# Altium schematic sheet USB.SchDoc: USB interfaces
size A3; Organization: Use Organization_Name in ProjParam; Address1: Eliot Ferragni; Address2: STI-MOBOTS; Address3: EPFL; Address4: CH-1015 LAUSANNE; DocumentNumber: 7; Revision: A; SheetNumber: 7; SheetTotal: 11; ApprovedBy: Init ApprovedBy in DocParam; CheckedBy: Init CheckedBy in DocParam; Author: Init Author in DocParam; CompanyName: Init CompanyName in DocParam; DrawnBy: Init DrawBy in DocParam; Engineer: Init Engineer in DocParam; Title2: USB-C connector, USB-PD, Hub, protection, HS Phy; DocumentName: Init DocumentName in DocParam; ProjectName: Init ProjectName in DocParam
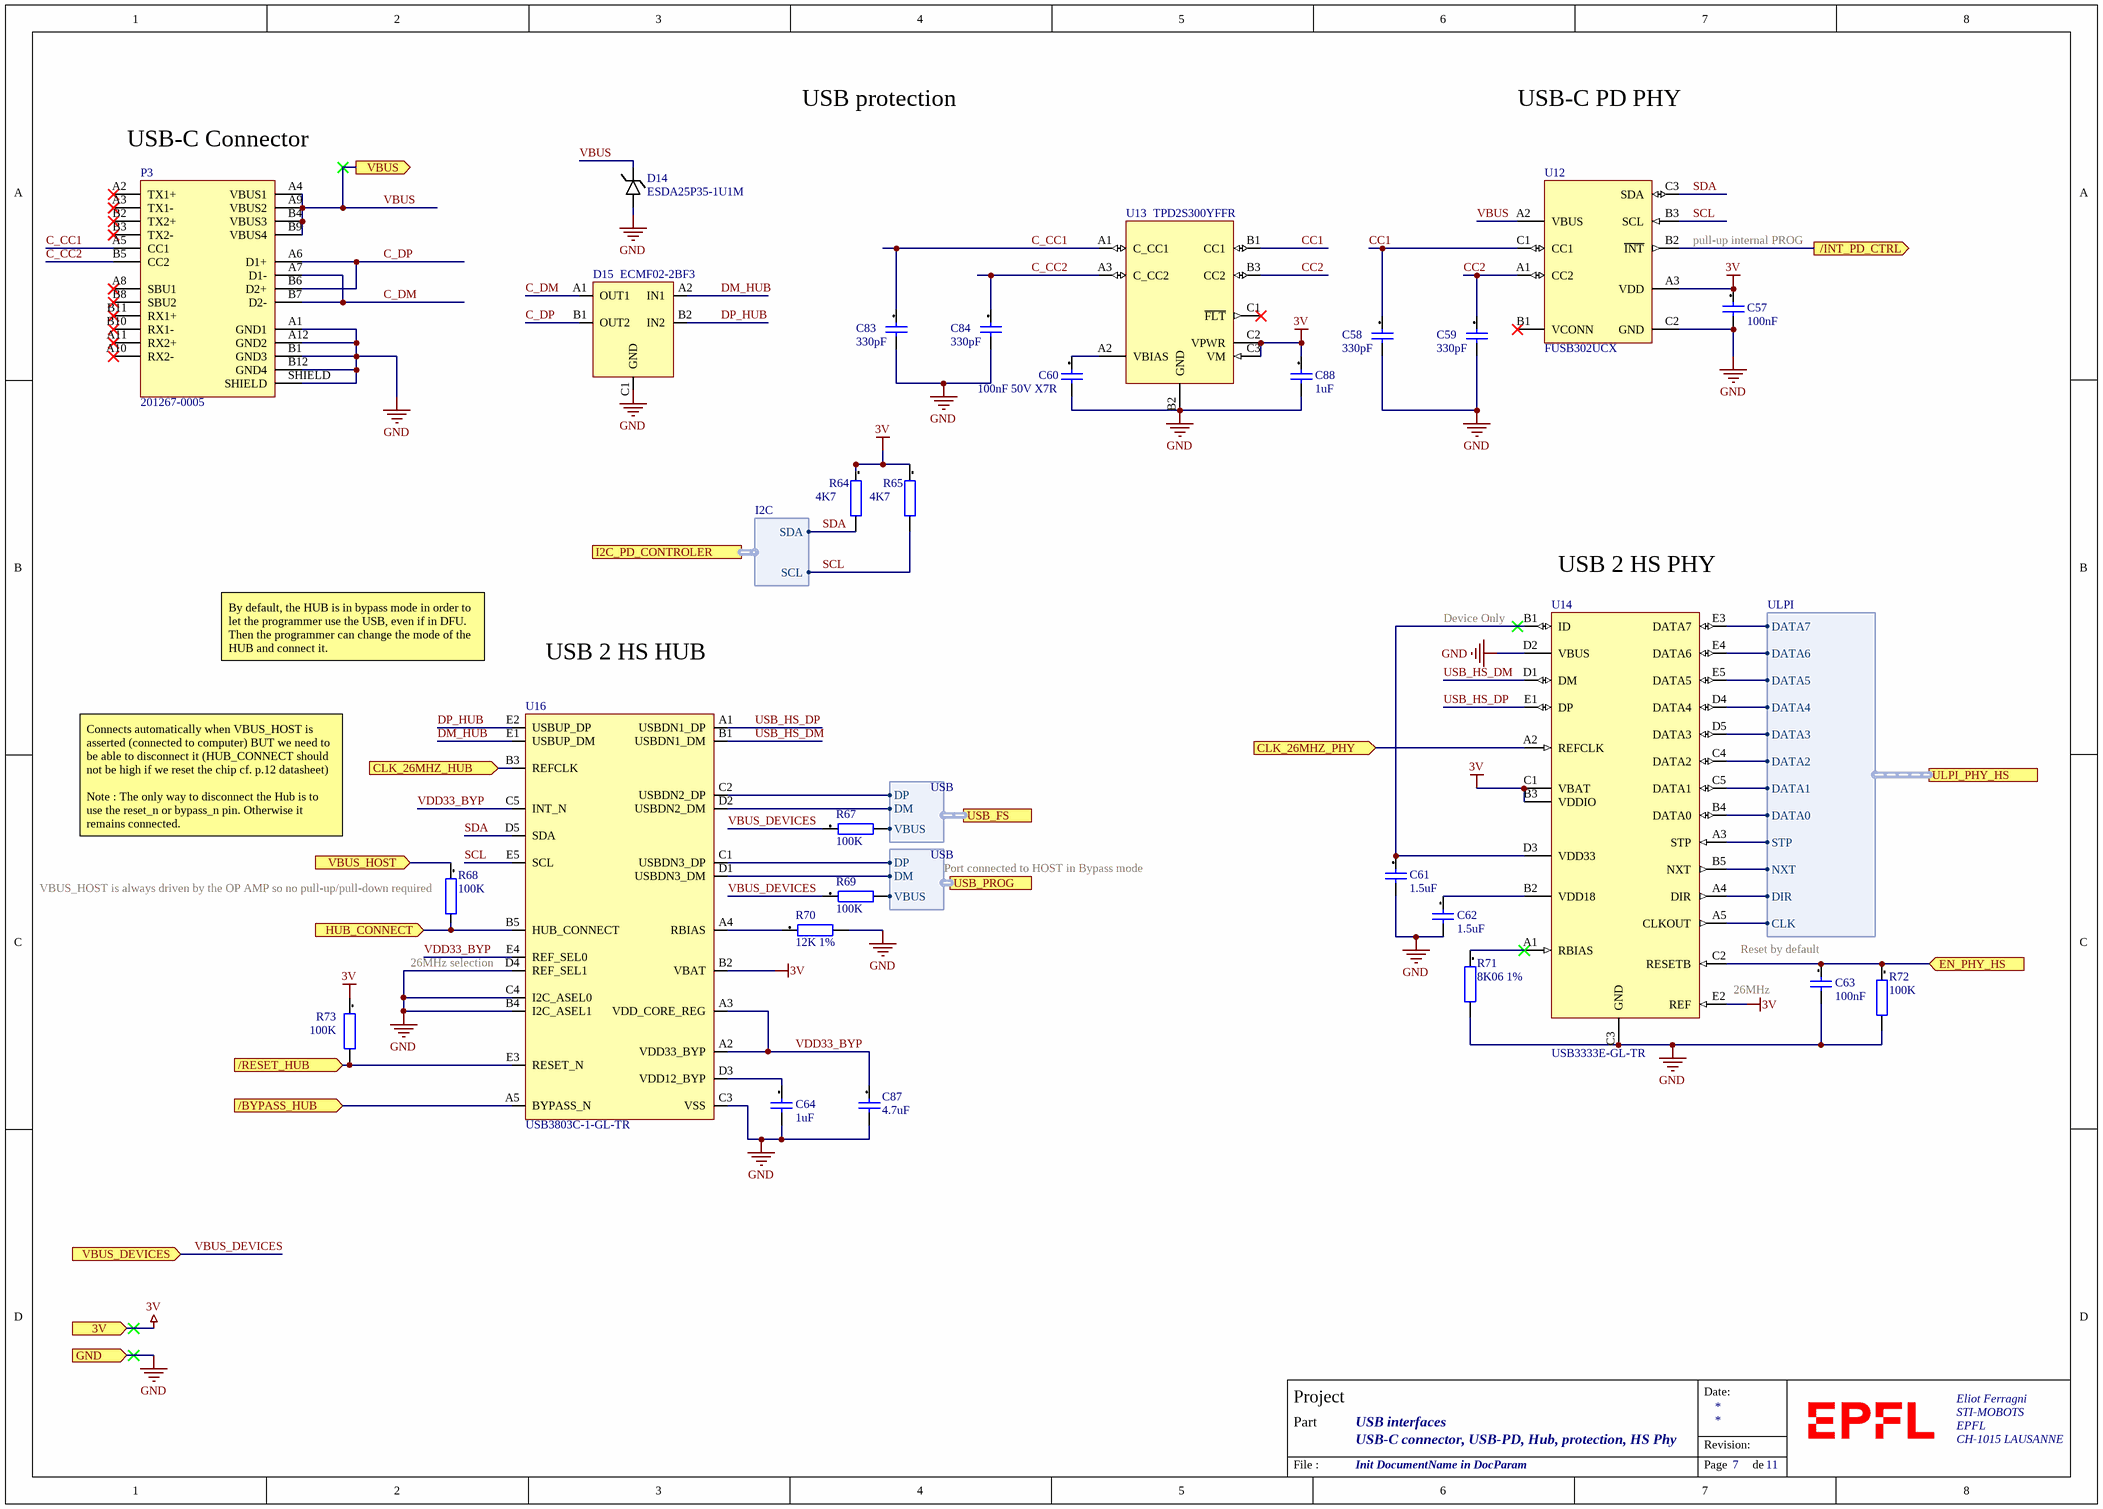
[diagram p0: USB.SchDoc]

## Parts
C57  100nF  [CAPC0201(0603)33_L]
C58  330pF  [CAPC0201(0603)33_L]
C59  330pF  [CAPC0201(0603)33_L]
C60  100nF 50V X7R  [CAPC1005X05L]
C61  1.5uF  [CAPC0201(0603)33_L]
C62  1.5uF  [CAPC0201(0603)33_L]
C63  100nF  [CAPC0201(0603)33_L]
C64  1uF  [CAPC0201(0603)33_L]
C83  330pF  [CAPC0201(0603)33_L]
C84  330pF  [CAPC0201(0603)33_L]
C87  4.7uF  [CAPC0201(0603)33_L]
C88  1uF  [CAPC0201(0603)33_L]
D14  ESDA25P35-1U1M  [0603 - diode]
D15  ECMF02-2BF3  [ECMF02-2BF3]
P3  201267-0005  [MOLEX_2012670005]
R64  4K7  [RESC0201(0603)_L]
R65  4K7  [RESC0201(0603)_L]
R67  100K  [RESC0201(0603)_L]
R68  100K  [RESC0201(0603)_L]
R69  100K  [RESC0201(0603)_L]
R70  12K 1%  [RESC0201(0603)_L]
R71  8K06 1%  [RESC0201(0603)_L]
R72  100K  [RESC0201(0603)_L]
R73  100K  [RESC0201(0603)_L]
U12  FUSB302UCX  [WLCSP9]
U13  TPD2S300YFFR  [WLCSP9 - ti]
U14  USB3333E-GL-TR  [25WLCSP]
U16  USB3803C-1-GL-TR  [25WLCSP]

## Ports
3V (in), /BYPASS_HUB (in), /INT_PD_CTRL (out), /RESET_HUB (in), CLK_26MHZ_HUB (in), CLK_26MHZ_PHY (in), EN_PHY_HS (in), GND (in), HUB_CONNECT (in), I2C_PD_CONTROLER (harness I2C), ULPI_PHY_HS (harness ULPI), USB_FS (harness USB), USB_PROG (harness USB), VBUS (out), VBUS_DEVICES (in), VBUS_HOST (in)

## Harnesses
USB: DM, DP, VBUS
ULPI: DATA7, DATA6, DATA5, DATA4, DATA3, DATA2, DATA1, DATA0, STP, NXT, DIR, CLK
I2C: SDA, SCL

## Nets
3V: C57.1 C88.1 R64.1 R65.1 R73.1 U12.A3(VDD) U13.C2(VPWR) U13.C3(VM) U14.B3(VDDIO) U14.C1(VBAT) U14.E2(REF) U16.B2(VBAT) ; port 3V
GND: C57.2 C58.2 C59.2 C60.2 C61.2 C62.2 C63.2 C64.2 C83.2 C84.2 C87.2 C88.2 D14.2(C) D15.C1(GND) P3.A1(GND1) P3.A12(GND2) P3.B1(GND3) P3.B12(GND4) P3.SHIELD R70.2 R71.2 R72.2 U12.C2(GND) U13.B2(GND) U14.C3(GND) U14.D2(VBUS) U16.B4(I2C_ASEL1) U16.C3(VSS) U16.C4(I2C_ASEL0) U16.D4(REF_SEL1) ; port GND
/BYPASS_HUB: U16.A5(BYPASS_N) ; port /BYPASS_HUB
/INT_PD_CTRL: U12.B2(~{INT}) ; port /INT_PD_CTRL
/RESET_HUB: R73.2 U16.E3(RESET_N) ; port /RESET_HUB
C_CC1: C83.1 P3.A5(CC1) U13.A1(C_CC1)
C_CC2: C84.1 P3.B5(CC2) U13.A3(C_CC2)
C_DM: D15.A1(OUT1) P3.A7(D1-) P3.B7(D2-)
C_DP: D15.B1(OUT2) P3.A6(D1+) P3.B6(D2+)
CC1: C58.1 U12.C1(CC1) U13.B1(CC1)
CC2: C59.1 U12.A1(CC2) U13.B3(CC2)
CLK_26MHZ_HUB: U16.B3(REFCLK) ; port CLK_26MHZ_HUB
CLK_26MHZ_PHY: U14.A2(REFCLK) ; port CLK_26MHZ_PHY
DM_HUB: D15.A2(IN1) U16.E1(USBUP_DM)
DP_HUB: D15.B2(IN2) U16.E2(USBUP_DP)
EN_PHY_HS: C63.1 R72.1 U14.C2(RESETB) ; port EN_PHY_HS
HUB_CONNECT: R68.2 U16.B5(HUB_CONNECT) ; port HUB_CONNECT
SCL: R65.2 U12.B3(SCL) U16.E5(SCL) ; port I2C_PD_CONTROLER.SCL
SDA: R64.2 U12.C3(SDA) U16.D5(SDA) ; port I2C_PD_CONTROLER.SDA
USB_HS_DM: U14.D1(DM) U16.B1(USBDN1_DM)
USB_HS_DP: U14.E1(DP) U16.A1(USBDN1_DP)
VBUS: D14.1(C) P3.A4(VBUS1) P3.A9(VBUS2) P3.B4(VBUS3) P3.B9(VBUS4) U12.A2(VBUS) ; port VBUS
VBUS_DEVICES: R67.1 R69.1 ; port VBUS_DEVICES
VBUS_HOST: R68.1 ; port VBUS_HOST
VDD33_BYP: C87.1 U16.A2(VDD33_BYP) U16.A3(VDD_CORE_REG) U16.C5(INT_N) U16.E4(REF_SEL0)
NetC60_1: C60.1 U13.A2(VBIAS)
NetC61_1: C61.1 U14.B1(ID) U14.D3(VDD33)
NetC62_1: C62.1 U14.B2(VDD18)
NetC64_1: C64.1 U16.D3(VDD12_BYP)
NetR67_2: R67.2 ; port USB_FS.VBUS
NetR69_2: R69.2 ; port USB_PROG.VBUS
NetR70_1: R70.1 U16.A4(RBIAS)
NetR71_1: R71.1 U14.A1(RBIAS)
NetU14_A3: U14.A3(STP) ; port ULPI_PHY_HS.STP
NetU14_A4: U14.A4(DIR) ; port ULPI_PHY_HS.DIR
NetU14_A5: U14.A5(CLKOUT) ; port ULPI_PHY_HS.CLK
NetU14_B4: U14.B4(DATA0) ; port ULPI_PHY_HS.DATA0
NetU14_B5: U14.B5(NXT) ; port ULPI_PHY_HS.NXT
NetU14_C4: U14.C4(DATA2) ; port ULPI_PHY_HS.DATA2
NetU14_C5: U14.C5(DATA1) ; port ULPI_PHY_HS.DATA1
NetU14_D4: U14.D4(DATA4) ; port ULPI_PHY_HS.DATA4
NetU14_D5: U14.D5(DATA3) ; port ULPI_PHY_HS.DATA3
NetU14_E3: U14.E3(DATA7) ; port ULPI_PHY_HS.DATA7
NetU14_E4: U14.E4(DATA6) ; port ULPI_PHY_HS.DATA6
NetU14_E5: U14.E5(DATA5) ; port ULPI_PHY_HS.DATA5
NetU16_C1: U16.C1(USBDN3_DP) ; port USB_PROG.DP
NetU16_C2: U16.C2(USBDN2_DP) ; port USB_FS.DP
NetU16_D1: U16.D1(USBDN3_DM) ; port USB_PROG.DM
NetU16_D2: U16.D2(USBDN2_DM) ; port USB_FS.DM

Not connected (* = marked no-connect by the designer): P3 A2(TX1+)* A3(TX1-)* A8(SBU1)* A10(RX2-)* A11(RX2+)* B2(TX2+)* B3(TX2-)* B8(SBU2)* B10(RX1-)* B11(RX1+)*; U12 B1(VCONN)*; U13 C1(~{FLT})*

## Notes on the sheet
- USB protection
- USB-C PD PHY
- (near P3) USB-C Connector
- pull-up internal PROG
- (near U14) USB 2 HS PHY
- (near U14) Device Only
- By default, the HUB is in bypass mode in order to let the programmer use the USB, even if in DFU. Then the programmer can change the mode of the HUB and connect it.
- USB 2 HS HUB
- Connects automatically when VBUS_HOST is asserted (connected to computer) BUT we need to be able to disconnect it (HUB_CONNECT should not be high if we reset the chip cf. p.12 datasheet)
  Note : The only way to disconnect the Hub is to use the reset_n or bypass_n pin. Otherwise it remains connected.
- (near R68) VBUS_HOST is always driven by the OP AMP so no pull-up/pull-down required
- Port connected to HOST in Bypass mode
- (near U16) 26MHz selection
- (near U14) 26MHz
- (near C63) Reset by default
- Date:
- Project
- Part
- Revision:
- File :
- Page
- de

## Library data of the parts
C57-C59 C61-C64 C83 C84 C87 C88 = TBD Capacitor[[/\]]0201[[/\]]1: Capacitor 0201; Preference: 1; Currentie: CHF; Type: SMD; Note: To buy by assembler; Size: 0201; Footprint Acort: 0201; ROHS: True; DateLastUpdate: 2018-10-19 / 8:59:52 AM; Manufacturer: -; Manufacturer part number: -; Package / Case: Capacitor 0201
C60 = TBD Capacitor[[/\]]0402[[/\]]1: Capacitor 0402; Preference: 1; Currentie: CHF; Type: SMD; Note: To buy by assembler; Size: 0402; Footprint Acort: 0402; ROHS: True; DateLastUpdate: 2012-11-19 / 14:35:51; Manufacturer: -; Manufacturer part number: -; Package / Case: Capacitor 0402
D14 = ESDA25P35-1U1M: TVS DIODE 22V 41V 1610; Manufacturer: STMicroelectronics; Type: SMD; Note: To buy by assembler; Supplier 1: Digi-Key; Stock 1: 80; Pricing 1: 1 = 0,46000, 10 = 0,37300, 100 = 0,25380, 500 = 0,19034, 1000 = 0,14276, 2500 = 0,13086 (USD); RoHS: No; ComponentLink1URL: http://www.farnell.com/datasheets/2236209.pdf?src-supplier=Farnell; ComponentLink1Description: http://www.farnell.com/datasheets/2236209.pdf?src-supplier=Farnell; ComponentLink2URL: http://www.st.com/content/ccc/resource/technical/document/datasheet/group3/e4/43/53/b9/4e/8a/40/bb/DM00312034/files/DM00312034.pdf/jcr:content/translations/en.DM00312034.pdf?src-supplier=Digi-Key; ComponentLink2Description: http://www.st.com/content/ccc/resource/technical/document/datasheet/group3/e4/43/53/b9/4e/8a/40/bb/DM00312034/files/DM00312034.pdf/jcr:content/translations/en.DM00312034.pdf?src-supplier=Digi-Key; ComponentLink3URL: http://www.farnell.com/datasheets/2236209.pdf?src-supplier=Newark; ComponentLink3Description: http://www.farnell.com/datasheets/2236209.pdf?src-supplier=Newark; Supplier Part Number 1: 497-16913-1-ND; Manufacturer Part Number: ESDA25P35-1U1M; Package / Case: QFN 1610
D15 = ECMF02-2BF3: IC ESD FILTER COM MODE 5FLIPCHIP; Manufacturer: STMicroelectronics; Number of Lines: 2; Frequency: 2.2GHz; DC Resistance (DCR): 3R; Type: SMD; Note: To buy by assembler; Supplier 1: Digi-Key; Stock 1: 11040; Pricing 1: 1=0.65, 10=0.56, 100=0.4182, 500=0.32858, 1000=0.2539 (USD); Mount: Surface Mount; Case/Package: SMD/SMT; Min Operating Temperature: -40°C; Max Operating Temperature: 85°C; Package Quantity: 5000; Packaging: Tape and Reel; Termination: Flat; Radiation Hardening: No; Lead Free: Lead Free; ComponentLink1URL: http://www.st.com/st-web-ui/static/active/en/resource/technical/document/data_brief/DM00047758.pdf; ComponentLink1Description: http://www.st.com/st-web-ui/static/active/en/resource/technical/document/data_brief/DM00047758.pdf; ComponentLink2URL: http://www.st.com/content/ccc/resource/technical/document/data_brief/b5/64/4d/9e/10/b2/49/ce/DM00047758.pdf/files/DM00047758.pdf/jcr:content/translations/en.DM00047758.pdf; ComponentLink2Description: http://www.st.com/content/ccc/resource/technical/document/data_brief/b5/64/4d/9e/10/b2/49/ce/DM00047758.pdf/files/DM00047758.pdf/jcr:content/translations/en.DM00047758.pdf; Supplier Part Number 1: 497-12953-1-ND; Manufacturer Part Number: ECMF02-2BF3; Package / Case: Flip Chip 5 bumps
P3 = 201267-0005: USB Shielded I/O Receptacle; Type C; Right Angle; Surface Mount; Gold over Nickel; Manufacturer: Molex; Note: To buy by assembler; Supplier 1: Digi-Key; Stock 1: 7138; Pricing 1: 1=2.77, 10=2.531, 25=2.3876, 50=2.292, 100=2.1965, 250=2.00552, 500=1.86228 (USD); Supplier Part Number 1: WM17992CT-ND; Manufacturer Part Number: 201267-0005; Type: Hybrid; Package / Case: USB Connector
R64 R65 R67-R73 = TBD[[/\]]0201[[/\]]1: Resistor 0201; Preference: 1; Currentie: CHF; Note: To buy by assembler; Size: 0201; Footprint Acort: 0201; ROHS: True; DateLastUpdate: 2018-10-19 / 9:06:49 AM; Type: SMD; Manufacturer: -; Manufacturer part number: -; Package / Case: Resistor 0201
U12 = FUSB302UCX: USB Type-C Port Controller 9-Pin WLCSP T/R; Manufacturer: ON Semiconductor / Fairchild; Operating Supply Current: 25uA; Note: To buy by assembler; Supplier 1: Digi-Key; Stock 1: 0; Mount: Surface Mount; Number of Pins: 9; Weight: 0.0373333g; Contact Plating: Copper,Silver,Tin; Min Operating Temperature: -40°C; Max Operating Temperature: 85°C; Packaging: Tape and Reel; Interface: USB; Lead Free: Lead Free; Supplier Part Number 1: FUSB302UCXCT-ND; Manufacturer Part Number: FUSB302UCX; Type: SMD; Package / Case: WLCSP-9
U13 = TPD2S300YFFR: IC OVERVOLTAGE PROT CTRL 9DSBGA; Manufacturer: Texas Instruments; Interface: USB; Note: To buy by assembler; Supplier 1: Digi-Key; Stock 1: 1190; Pricing 1: 1=1.22, 10=1.094, 100=0.8532, 500=0.70482, 1000=0.55643 (USD); Min Operating Temperature: -40°C; Max Operating Temperature: 85°C; Supplier Part Number 1: 296-50034-1-ND; Manufacturer Part Number: TPD2S300YFFR; Type: SMD; Package / Case: DSBGA-9
U14 = USB3333E-GL-TR: IC TXRX USB 2.0 FLEXPWR 25WLCSP; Manufacturer: Microchip; Data Rate: 480Mbps; Note: To buy by assembler; Supplier 1: Digi-Key; Stock 1: 0; Pricing 1: 3000 = 1,47949 (USD); RoHS: Yes; Packaging: Tape and Reel; Package Quantity: 3000; ComponentLink1URL: https://datasheet.ciiva.com/6634/usb333x-6634538.pdf?src-supplier=Digi-Key; ComponentLink1Description: https://datasheet.ciiva.com/6634/usb333x-6634538.pdf?src-supplier=Digi-Key; Supplier Part Number 1: USB3333E-GL-TR-ND; Manufacturer Part Number: USB3333E-GL-TR; Type: SMD; Package / Case: 25WLCSP
U16 = USB3803C-1-GL-TR: IC HUB CTLR 3PORT USB 2.0 25CSP; Manufacturer: Microchip; Data Rate: 480Mbps; Min Supply Voltage: 1.2V; Operating Supply Voltage: 3.3V; Interface: USB,Serial; Max Supply Voltage: 3.6V; Number of Ports: 3; ESD Protection: Yes; USB Standard: USB 2.0; Supplier 1: Digi-Key; Stock 1: 0; Pricing 1: 3000 = 1,97266 (USD); RoHS: Yes; Mount: Surface Mount; Number of Pins: 25; Min Operating Temperature: 0°C; Max Operating Temperature: 70°C; Packaging: Tape and Reel; Package Quantity: 1; Number of Transceivers: 3; Length: 2mm; Height: 0.38mm; Width: 2mm; Radiation Hardening: No; REACH SVHC: No SVHC; Lead Free: Lead Free; ComponentLink1URL: https://datasheet.ciiva.com/18456/usb3803-18456930.pdf?src-supplier=Digi-Key; ComponentLink1Description: https://datasheet.ciiva.com/18456/usb3803-18456930.pdf?src-supplier=Digi-Key; ComponentLink2URL: https://datasheet.ciiva.com/6636/usb3803-6636271.pdf?src-supplier=Digi-Key; ComponentLink2Description: https://datasheet.ciiva.com/6636/usb3803-6636271.pdf?src-supplier=Digi-Key; Supplier Part Number 1: USB3803C-1-GL-TR-ND; Manufacturer Part Number: USB3803C-1-GL-TR